# EAGLE schematic LEDARRAY (EAGLE 8.6.0)
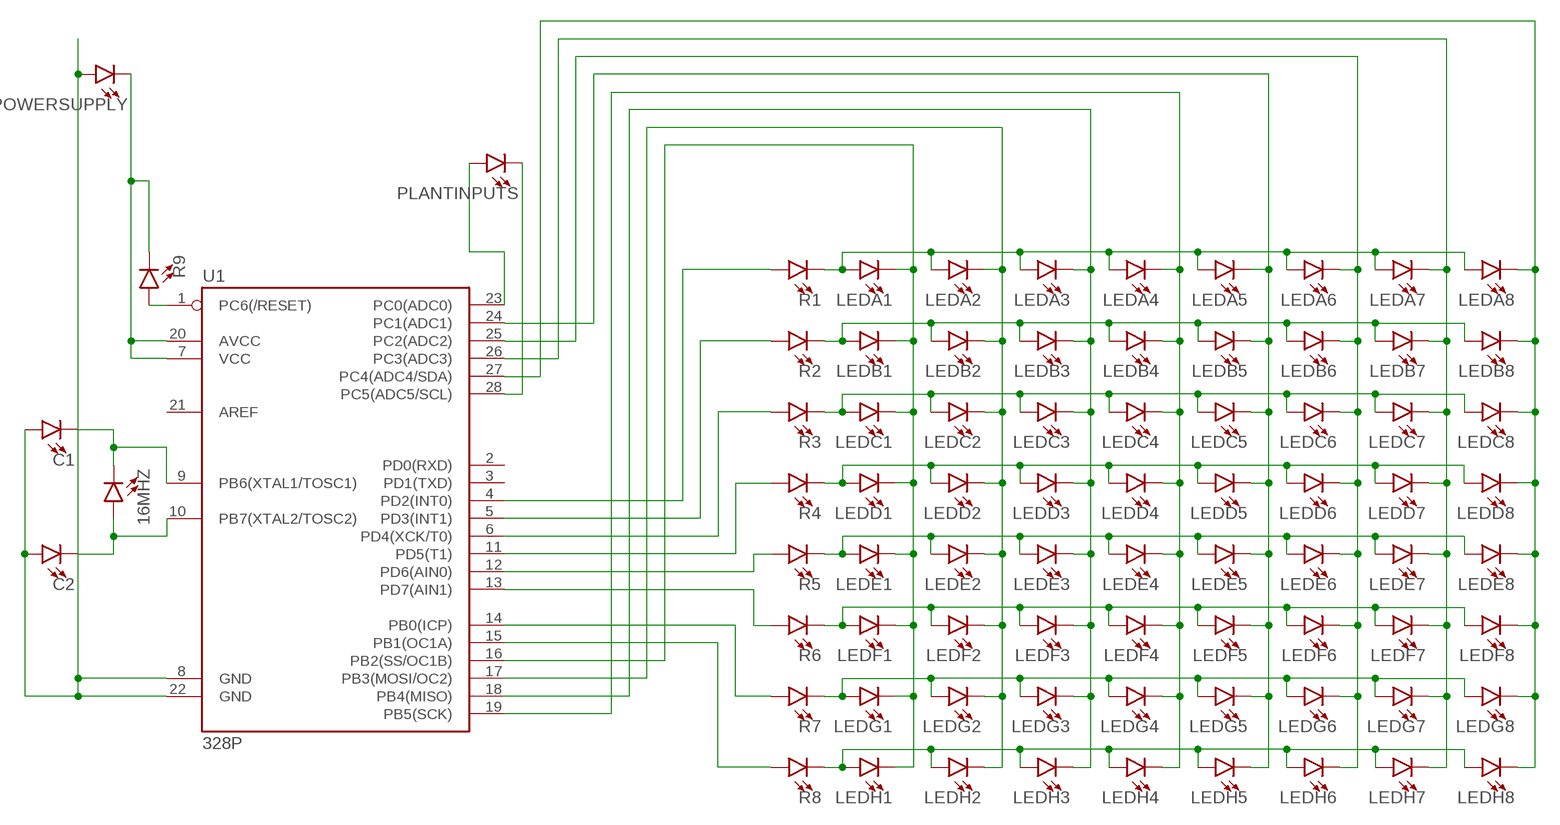
[diagram p0: schematic, sheet 1]

## Parts
16MHZ  LED3MM  [LED_3MM]
C1  LED3MM  [LED_3MM]
C2  LED3MM  [LED_3MM]
LEDA1  LED3MM  [LED_3MM]
LEDA2  LED3MM  [LED_3MM]
LEDA3  LED3MM  [LED_3MM]
LEDA4  LED3MM  [LED_3MM]
LEDA5  LED3MM  [LED_3MM]
LEDA6  LED3MM  [LED_3MM]
LEDA7  LED3MM  [LED_3MM]
LEDA8  LED3MM  [LED_3MM]
LEDB1  LED3MM  [LED_3MM]
LEDB2  LED3MM  [LED_3MM]
LEDB3  LED3MM  [LED_3MM]
LEDB4  LED3MM  [LED_3MM]
LEDB5  LED3MM  [LED_3MM]
LEDB6  LED3MM  [LED_3MM]
LEDB7  LED3MM  [LED_3MM]
LEDB8  LED3MM  [LED_3MM]
LEDC1  LED3MM  [LED_3MM]
LEDC2  LED3MM  [LED_3MM]
LEDC3  LED3MM  [LED_3MM]
LEDC4  LED3MM  [LED_3MM]
LEDC5  LED3MM  [LED_3MM]
LEDC6  LED3MM  [LED_3MM]
LEDC7  LED3MM  [LED_3MM]
LEDC8  LED3MM  [LED_3MM]
LEDD1  LED3MM  [LED_3MM]
LEDD2  LED3MM  [LED_3MM]
LEDD3  LED3MM  [LED_3MM]
LEDD4  LED3MM  [LED_3MM]
LEDD5  LED3MM  [LED_3MM]
LEDD6  LED3MM  [LED_3MM]
LEDD7  LED3MM  [LED_3MM]
LEDD8  LED3MM  [LED_3MM]
LEDE1  LED3MM  [LED_3MM]
LEDE2  LED3MM  [LED_3MM]
LEDE3  LED3MM  [LED_3MM]
LEDE4  LED3MM  [LED_3MM]
LEDE5  LED3MM  [LED_3MM]
LEDE6  LED3MM  [LED_3MM]
LEDE7  LED3MM  [LED_3MM]
LEDE8  LED3MM  [LED_3MM]
LEDF1  LED3MM  [LED_3MM]
LEDF2  LED3MM  [LED_3MM]
LEDF3  LED3MM  [LED_3MM]
LEDF4  LED3MM  [LED_3MM]
LEDF5  LED3MM  [LED_3MM]
LEDF6  LED3MM  [LED_3MM]
LEDF7  LED3MM  [LED_3MM]
LEDF8  LED3MM  [LED_3MM]
LEDG1  LED3MM  [LED_3MM]
LEDG2  LED3MM  [LED_3MM]
LEDG3  LED3MM  [LED_3MM]
LEDG4  LED3MM  [LED_3MM]
LEDG5  LED3MM  [LED_3MM]
LEDG6  LED3MM  [LED_3MM]
LEDG7  LED3MM  [LED_3MM]
LEDG8  LED3MM  [LED_3MM]
LEDH1  LED3MM  [LED_3MM]
LEDH2  LED3MM  [LED_3MM]
LEDH3  LED3MM  [LED_3MM]
LEDH4  LED3MM  [LED_3MM]
LEDH5  LED3MM  [LED_3MM]
LEDH6  LED3MM  [LED_3MM]
LEDH7  LED3MM  [LED_3MM]
LEDH8  LED3MM  [LED_3MM]
PLANTINPUTS  LED3MM  [LED_3MM]
POWERSUPPLY  LED3MM  [LED_3MM]
R1  LED3MM  [LED_3MM]
R2  LED3MM  [LED_3MM]
R3  LED3MM  [LED_3MM]
R4  LED3MM  [LED_3MM]
R5  LED3MM  [LED_3MM]
R6  LED3MM  [LED_3MM]
R7  LED3MM  [LED_3MM]
R8  LED3MM  [LED_3MM]
R9  LED3MM  [LED_3MM]
U1  328P  ATMEGA328P_PDIP  [DIP28]

## Nets
LEDD1: LEDA1.K(C) LEDB1.K(C) LEDC1.K(C) LEDD1.K(C) LEDE1.K(C) LEDF1.K(C) LEDG1.K(C) LEDH1.K(C) U1.16(PB2(SS/OC1B))
N$1: R8.A U1.15(PB1(OC1A))
N$2: LEDG1.A LEDG2.A LEDG3.A LEDG4.A LEDG5.A LEDG6.A LEDG7.A LEDG8.A R7.K(C)
N$3: LEDF1.A LEDF2.A LEDF3.A LEDF4.A LEDF5.A LEDF6.A LEDF7.A LEDF8.A R6.K(C)
N$4: LEDH1.A LEDH2.A LEDH3.A LEDH4.A LEDH5.A LEDH6.A LEDH7.A LEDH8.A R8.K(C)
N$5: LEDD1.A LEDD2.A LEDD3.A LEDD4.A LEDD5.A LEDD6.A LEDD7.A LEDD8.A R4.K(C)
N$6: LEDE1.A LEDE2.A LEDE3.A LEDE4.A LEDE5.A LEDE6.A LEDE7.A LEDE8.A R5.K(C)
N$7: R6.A U1.13(PD7(AIN1))
N$8: LEDA6.K(C) LEDB6.K(C) LEDC6.K(C) LEDD6.K(C) LEDE6.K(C) LEDF6.K(C) LEDG6.K(C) LEDH6.K(C) U1.25(PC2(ADC2))
N$9: LEDA2.K(C) LEDB2.K(C) LEDC2.K(C) LEDD2.K(C) LEDE2.K(C) LEDF2.K(C) LEDG2.K(C) LEDH2.K(C) U1.17(PB3(MOSI/OC2))
N$10: R7.A U1.14(PB0(ICP))
N$11: LEDA3.K(C) LEDB3.K(C) LEDC3.K(C) LEDD3.K(C) LEDE3.K(C) LEDF3.K(C) LEDG3.K(C) LEDH3.K(C) U1.18(PB4(MISO))
N$12: LEDB1.A LEDB2.A LEDB3.A LEDB4.A LEDB5.A LEDB6.A LEDB7.A LEDB8.A R2.K(C)
N$13: PLANTINPUTS.A U1.23(PC0(ADC0))
N$14: LEDA5.K(C) LEDB5.K(C) LEDC5.K(C) LEDD5.K(C) LEDE5.K(C) LEDF5.K(C) LEDG5.K(C) LEDH5.K(C) U1.24(PC1(ADC1))
N$16: 16MHZ.K(C) C1.K(C) U1.9(PB6(XTAL1/TOSC1))
N$17: R9.A U1.1(PC6(/RESET))
N$18: R5.A U1.12(PD6(AIN0))
N$19: R4.A U1.11(PD5(T1))
N$20: LEDA7.K(C) LEDB7.K(C) LEDC7.K(C) LEDD7.K(C) LEDE7.K(C) LEDF7.K(C) LEDG7.K(C) LEDH7.K(C) U1.26(PC3(ADC3))
N$21: LEDC1.A LEDC2.A LEDC3.A LEDC4.A LEDC5.A LEDC6.A LEDC7.A LEDC8.A R3.K(C)
N$22: LEDA8.K(C) LEDB8.K(C) LEDC8.K(C) LEDD8.K(C) LEDE8.K(C) LEDF8.K(C) LEDG8.K(C) LEDH8.K(C) U1.27(PC4(ADC4/SDA))
N$23: R2.A U1.5(PD3(INT1))
N$24: R1.A U1.4(PD2(INT0))
N$25: PLANTINPUTS.K(C) U1.28(PC5(ADC5/SCL))
N$26: POWERSUPPLY.K(C) R9.K(C) U1.7(VCC) U1.20(AVCC)
N$27: LEDA4.K(C) LEDB4.K(C) LEDC4.K(C) LEDD4.K(C) LEDE4.K(C) LEDF4.K(C) LEDG4.K(C) LEDH4.K(C) U1.19(PB5(SCK))
N$28: 16MHZ.A C2.K(C) U1.10(PB7(XTAL2/TOSC2))
N$30: R3.A U1.6(PD4(XCK/T0))
N$32: LEDA1.A LEDA2.A LEDA3.A LEDA4.A LEDA5.A LEDA6.A LEDA7.A LEDA8.A R1.K(C)
POWERSUPPLY: C1.A C2.A POWERSUPPLY.A U1.8(GND) U1.22(GND)
Unconnected: U1.2(PD0(RXD)) U1.3(PD1(TXD)) U1.21(AREF)

## Library data of the parts
16MHZ C1 C2 LEDA1-LEDA8 LEDB1-LEDB8 LEDC1-LEDC8 LEDD1-LEDD8 LEDE1-LEDE8 LEDF1-LEDF8 LEDG1-LEDG8 LEDH1-LEDH8 PLANTINPUTS POWERSUPPLY R1-R9 = SparkFun-LED:LED: LED (Generic) Standard schematic elements and footprints for 5mm, 3mm, 1206, and 0603 sized LEDs. Generic LEDs with no color specified.; PROD_ID: DIO-08794
U1 = SparkFun-IC-Microcontroller:ATMEGA328P_PDIP: Atmel 328P Through hole ATMEGA328P uC used in the Arduino 32kb flash, 1k EEPROM, 2k SRAM Datasheet <http://www.sparkfun.com/datasheets/Components/SMD/ATMega328.pdf> SparkFun Products Storefront component: AVR 28 Pin 20MHz 32K 6A/D - ATMega328P <https://www.sparkfun.com/products/9061> (COM-09061) SparkFun Simon Says - Through-Hole Soldering Kit <https://www.sparkfun.com/products/10547> (KIT-10547) SparkFun Learn to Solder - Simon Says <https://www.sparkfun.com/products/13708> (KIT-13708) SparkFun BigTime Watch Kit <https://www.sparkfun.com/products/11734> (KIT-11734) SparkFun ClockIt <https://www.sparkfun.com/products/10930> (KIT-10930) SparkFun Serial Enabled LCD Kit <https://www.sparkfun.com/products/10097> (LCD-10097) SparkFun Simon Tilts - Through Hole Soldering Kit <https://www.sparkfun.com/products/12634> (KIT-12634) SparkFun Frequency Counter Kit <https://www.sparkfun.com/products/10140> (KIT-10140) FabFM Radio Kit <https://www.sparkfun.com/products/11043> (KIT-11043) SparkFun Binary Blaster Kit <https://www.sparkfun.com/products/12037> (KIT-12037) SparkFun Metro-Gnome <https://www.sparkfun.com/products/9236> (KIT-09236) ATmega328 with Arduino Optiboot (Uno) <https://www.sparkfun.com/products/10524> (DEV-10524); PROD_ID: IC-09136